# Altium schematic sheet CW340_STATUS_LEDs.SchDoc: User LED / Switches
size Letter; Organization: NewAE Technology Inc.; Address1: 1083 Queen St., Suite 196; Address2: Halifax; Address3: NS; Address4: Canada B3H 0B2; DocumentNumber: .; Revision: .; SheetNumber: 30; SheetTotal: 31; SheetApproved: NO
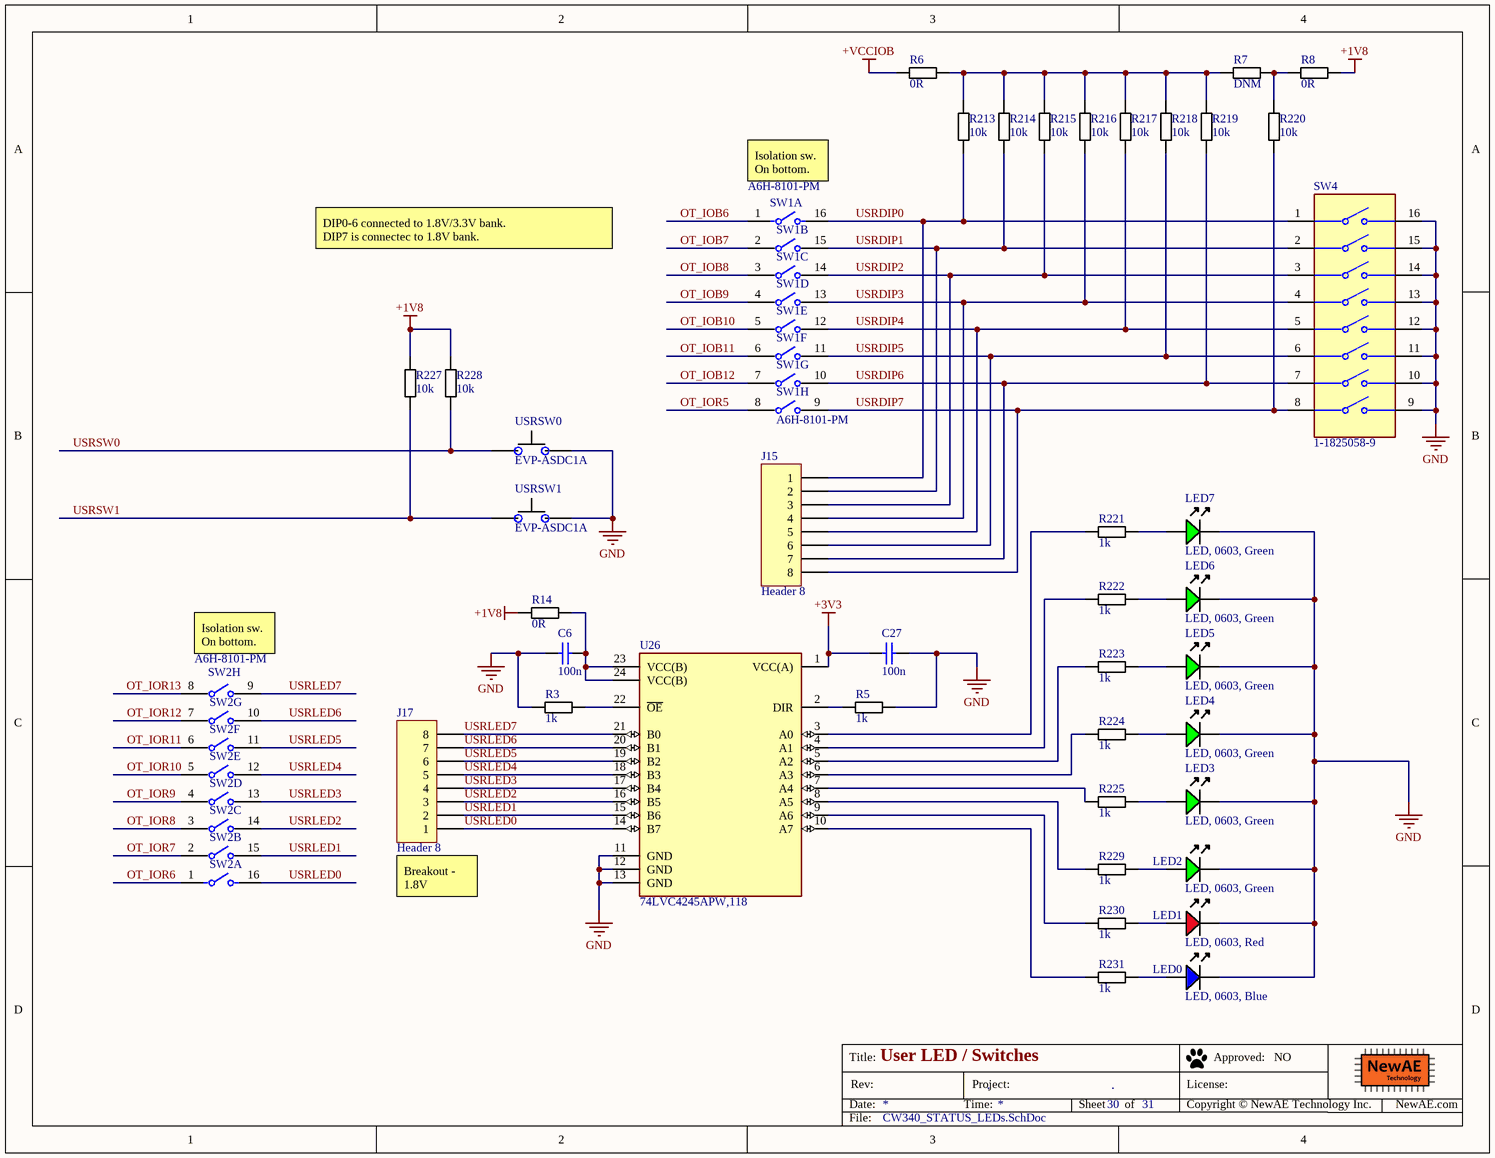
[diagram p0: CW340_STATUS_LEDs.SchDoc]

## Parts
C6  100n  [CAPC0402_M]
C27  100n  [CAPC0402_M]
J15  Header 8  [HDR1X8]
J17  Header 8  [HDR1X8]
LED0  LED, 0603, Blue  [LED-0603-BLUE]
LED1  LED, 0603, Red  [LED-0603-RED]
LED2  LED, 0603, Green  [LED-0603-GREEN]
LED3  LED, 0603, Green  [LED-0603-GREEN]
LED4  LED, 0603, Green  [LED-0603-GREEN]
LED5  LED, 0603, Green  [LED-0603-GREEN]
LED6  LED, 0603, Green  [LED-0603-GREEN]
LED7  LED, 0603, Green  [LED-0603-GREEN]
R3  1k  [RESC1005X40N]
R5  1k  [RESC1005X40N]
R6  0R  [RESC1005X40N]
R7  DNM  [RESC1005X40N]
R8  0R  [RESC1005X40N]
R14  0R  [RESC1005X40N]
R213  10k  [RESC1005X40N]
R214  10k  [RESC1005X40N]
R215  10k  [RESC1005X40N]
R216  10k  [RESC1005X40N]
R217  10k  [RESC1005X40N]
R218  10k  [RESC1005X40N]
R219  10k  [RESC1005X40N]
R220  10k  [RESC1005X40N]
R221  1k  [RESC1005X40N]
R222  1k  [RESC1005X40N]
R223  1k  [RESC1005X40N]
R224  1k  [RESC1005X40N]
R225  1k  [RESC1005X40N]
R227  10k  [RESC1005X40N]
R228  10k  [RESC1005X40N]
R229  1k  [RESC1005X40N]
R230  1k  [RESC1005X40N]
R231  1k  [RESC1005X40N]
SW1  A6H-8101-PM  [FP-A6H-8101-PM-MFG]  (parts A,B,C,D,E,F,G,H of 8)
SW2  A6H-8101-PM  [FP-A6H-8101-PM-MFG]  (value not drawn)  (parts A,B,C,D,E,F,G,H of 8)
SW4  1-1825058-9  [FP-1-1825058-9-MFG]
U26  74LVC4245APW,118  [FP-SOT355-1-MFG]
USRSW0  EVP-ASDC1A  [EVPAS]
USRSW1  EVP-ASDC1A  [EVPAS]

## Nets
+1V8: R8.2 R14.1 R227.1 R228.1
+3V3: C27.1 U26.1(VCC(A))
+VCCIOB: R6.1
GND: C6.1 C27.2 LED0.K LED1.K LED2.K LED3.K LED4.K LED5.K LED6.K LED7.K R3.1 R5.2 SW4.9 SW4.10 SW4.11 SW4.12 SW4.13 SW4.14 SW4.15 SW4.16 U26.11(GND) U26.12(GND) U26.13(GND) USRSW0.2(IN) USRSW1.2(IN)
OT_IOB6: SW1.1
OT_IOB7: SW1.2
OT_IOB8: SW1.3
OT_IOB9: SW1.4
OT_IOB10: SW1.5
OT_IOB11: SW1.6
OT_IOB12: SW1.7
OT_IOR5: SW1.8
OT_IOR6: SW2.1
OT_IOR7: SW2.2
OT_IOR8: SW2.3
OT_IOR9: SW2.4
OT_IOR10: SW2.5
OT_IOR11: SW2.6
OT_IOR12: SW2.7
OT_IOR13: SW2.8
USRDIP0: J15.1 R213.2 SW1.16 SW4.1
USRDIP1: J15.2 R214.2 SW1.15 SW4.2
USRDIP2: J15.3 R215.2 SW1.14 SW4.3
USRDIP3: J15.4 R216.2 SW1.13 SW4.4
USRDIP4: J15.5 R217.2 SW1.12 SW4.5
USRDIP5: J15.6 R218.2 SW1.11 SW4.6
USRDIP6: J15.7 R219.2 SW1.10 SW4.7
USRDIP7: J15.8 R220.2 SW1.9 SW4.8
USRLED0: J17.1 SW2.16 U26.14(B7)
USRLED1: J17.2 SW2.15 U26.15(B6)
USRLED2: J17.3 SW2.14 U26.16(B5)
USRLED3: J17.4 SW2.13 U26.17(B4)
USRLED4: J17.5 SW2.12 U26.18(B3)
USRLED5: J17.6 SW2.11 U26.19(B2)
USRLED6: J17.7 SW2.10 U26.20(B1)
USRLED7: J17.8 SW2.9 U26.21(B0)
USRSW0: R228.2 USRSW0.1(IN)
USRSW1: R227.2 USRSW1.1(IN)
NetC6_2: C6.2 R14.2 U26.23(VCC(B)) U26.24(VCC(B))
NetLED0_A: LED0.A R231.2
NetLED1_A: LED1.A R230.2
NetLED2_A: LED2.A R229.2
NetLED3_A: LED3.A R225.2
NetLED4_A: LED4.A R224.2
NetLED5_A: LED5.A R223.2
NetLED6_A: LED6.A R222.2
NetLED7_A: LED7.A R221.2
NetR3_2: R3.2 U26.22(~{OE})
NetR5_1: R5.1 U26.2(DIR)
NetR6_2: R6.2 R7.1 R213.1 R214.1 R215.1 R216.1 R217.1 R218.1 R219.1
NetR7_2: R7.2 R8.1 R220.1
NetR221_1: R221.1 U26.3(A0)
NetR222_1: R222.1 U26.4(A1)
NetR223_1: R223.1 U26.5(A2)
NetR224_1: R224.1 U26.6(A3)
NetR225_1: R225.1 U26.7(A4)
NetR229_1: R229.1 U26.8(A5)
NetR230_1: R230.1 U26.9(A6)
NetR231_1: R231.1 U26.10(A7)

## Notes on the sheet
- (near SW1) Isolation sw. On bottom.
- DIP0-6 connected to 1.8V/3.3V bank.
  DIP7 is connectec to 1.8V bank.
- (near SW2) Isolation sw. On bottom.
- (near J17) Breakout - 1.8V
- Title:
- Date:
- Rev:
- Time:
- Project:
- Sheet
- of
- License:
- Copyright © NewAE Technology Inc.
- Approved:
- NewAE.com
- File:

## Library data of the parts
C6 C27 = CCHIP-100n-0402: 100n, 0402; Manufacture Part Number 1: CGA2B3X7R1V104K050BB; Component Group: Capacitor; Case-EIA: 0402; Part Number: CCHIP-100n-0402; Footprint: 0402; Pin Count: 2; Supplier 1: Digi-Key; Supplier Part Number 1: 445-6901-1-ND; Value: 100n; Mounting Technology: SMT; Component Kind: Standard; Component Type: Standard
J15 J17 = Header 8: Header, 8-Pin; LatestRevisionDate: 17-Jul-2002; LatestRevisionNote: Re-released for DXP Platform.; Publisher: Altium Limited
LED0 = LEDCHIP_0603_BLUE: Chip LED, Blue; Manufacture 1: Kingbright; Manufacture Part Number 1: APT1608QBC/D; Component Group: Optical; Part Number: LEDCHIP_0603_BLUE; Pin Count: 2; Mounting Technology: SMT; Component Kind: Standard; Component Type: Standard
LED1 = LEDCHIP_0603_RED: Chip LED, Red; Manufacture 1: Kingbright; Manufacture Part Number 1: APT1608SRCPRV; Component Group: Optical; PP Material Stack: 15; PP Rotation: -90; Part Number: LEDCHIP_0603_RED; Pin Count: 2; Supplier 1: Digi-Key; Supplier Part Number 1: 754-1122-1-ND; Mounting Technology: SMT; Component Kind: Standard; Component Type: Standard
LED2-LED7 = LEDCHIP_0603_GREEN: Chip LED, Green; Manufacture 1: Kingbright; Manufacture Part Number 1: APT1608CGCK; Component Group: Optical; PP Material Stack: 16; PP Rotation: -90; Part Number: LEDCHIP_0603_GREEN; Pin Count: 2; Supplier 1: Digi-Key; Supplier Part Number 1: 754-1116-1-ND; Mounting Technology: SMT; Component Kind: Standard; Component Type: Standard
R3 R5 R221-R225 R229-R231 = RCHIP-1K-0402: 1k res, 0402, 1%, 1/16W; Manufacture 1: Yageo; Manufacture Part Number 1: RC0402FR-071KL; Component Group: Resistor; Case-EIA: 0402; Case-Metric: 1005; Rated Power: 0.063W; Rated Voltage: 75VDC; Part Number: RCHIP-1K-0402; Footprint: 0402; Pin Count: 2; Supplier 1: Digi-Key; Supplier Part Number 1: 311-1.00KLRCT-ND; Value: 1k; Tolerance: 1%; Mounting Technology: SMT; Temperature Range: -55C to 155C; Component Kind: Standard; Component Type: Standard
R6 R8 R14 = RCHIP-0R-0402: Manufacture 1: Yageo; Manufacture Part Number 1: RC0402FR-070RL; Component Group: Resistor; Case-EIA: 0402; Case-Metric: 1005; Part Number: RCHIP-0R-0402; Footprint: 0402; Pin Count: 2; Supplier 1: Digi-Key; Supplier Part Number 1: 311-0.0LRCT-ND; Value: 0R; Component Kind: Standard; Component Type: Standard
R7 = RCHIP-DNM-0402: Component Group: Resistor; Case-EIA: 0402; Case-Metric: 1005; Part Number: RCHIP-DNM-0402; Footprint: 0402; Pin Count: 2; Value: DNM; Component Kind: Standard; Component Type: Standard
R213-R220 R227 R228 = RCHIP-10K-0402: 10k res, 0402, 1%, 1/16W; Manufacture 1: Yageo; Manufacture Part Number 1: RC0402FR-0710KL; Component Group: Resistor; Case-EIA: 0402; Case-Metric: 1005; Rated Power: 0.063W; Rated Voltage: 75VDC; Part Number: RCHIP-10K-0402; Footprint: 0402; Pin Count: 2; Supplier 1: Digi-Key; Supplier Part Number 1: 311-10.0KLRCT-ND; Value: 10k; Tolerance: 1%; Mounting Technology: SMT; Temperature Range: -55C to 155C; Component Kind: Standard; Component Type: Standard
SW1 SW2 = CMP-08827-000045-1: SWITCH SLIDE DIP SPST 25MA 24V; Number of Positions: 8; Actuator Type: Slide (Standard); Mechanical Life: 1000Cycles; Pitch: 0.05inch; Washable: No; Radiation Hardening: No; Max Operating Temperature: 70°C; Packaging: Tape and Reel; Max Current Rating: 25mA; Mount: Surface Mount; Voltage Rating (DC): 24V; Package Quantity: 4000; Length: 0.448inch; Depth: 6.7mm; Orientation: Straight; Throw Configuration: SPST; Termination: Gull Wing; Max Voltage Rating (DC): 24V; Series: A6H; Min Operating Temperature: -20°C; Current Rating: 25mA; Electrical Life: 1000Cycles
SW4 = CMP-03400-000015-1: SWITCH SLIDE DIP SPST 100MA 24V; Manufacturer: TE Connectivity; Current Rating: 1A; Electromechanical Life: 1000Cycles; Contact Resistance: 50mΩ; Number Of Circuits: 8; Device Class L1: Electromechanical; Manufacturer Part Number: 1-1825058-9; Height: 5.1mm; ComponentLink2Description: Datasheet; Temperature Range High: +85°C; Digikey Description: SWITCH SLIDE DIP SPST 100MA 24V; Voltage Rating Dc: 24V; Package: 0; Automotive: No; ComponentLink2URL: https://www.te.com/commerce/DocumentDelivery/DDEController?Action=showdoc&DocId=Customer+Drawing%7F1825058%7FS5%7Fpdf%7FEnglish%7FENG_CD_1825058_S5.pdf%7F1-1825058-9; Octopart: https://octopart.com/1-1825058-9-te+connectivity-46507285; Temperature Range Low: -30°C; Device Class L2: Switches; Contact Current Rating: 100mA; Mount: Surface Mount; Temperature: -30°C to +85°C; Category: Switch; Device Class L3: DIP Switches; Lead Free: Yes; Throw Configuration: SPST; RoHS: TRUE
U26 = CMP-14346-000006-1: IC TRNSLTR BIDIRECTIONAL 24TSSOP; RoHS Compliant: Yes
USRSW0 USRSW1 = EVP-ASDC1A: Pushbutton, SMD, 2.5NM force, NO; Manufacture 1: Panasonic; Component Group: Switch; Part Number: EVP-ASDC1A; Manufacture Part Number 1: EVP-ASDC1A; Pin Count: 2; Supplier 1: Digi-Key; Supplier Part Number 1: P16856CT-ND; Mounting Technology: SMT; Component Kind: Standard; Component Type: Standard